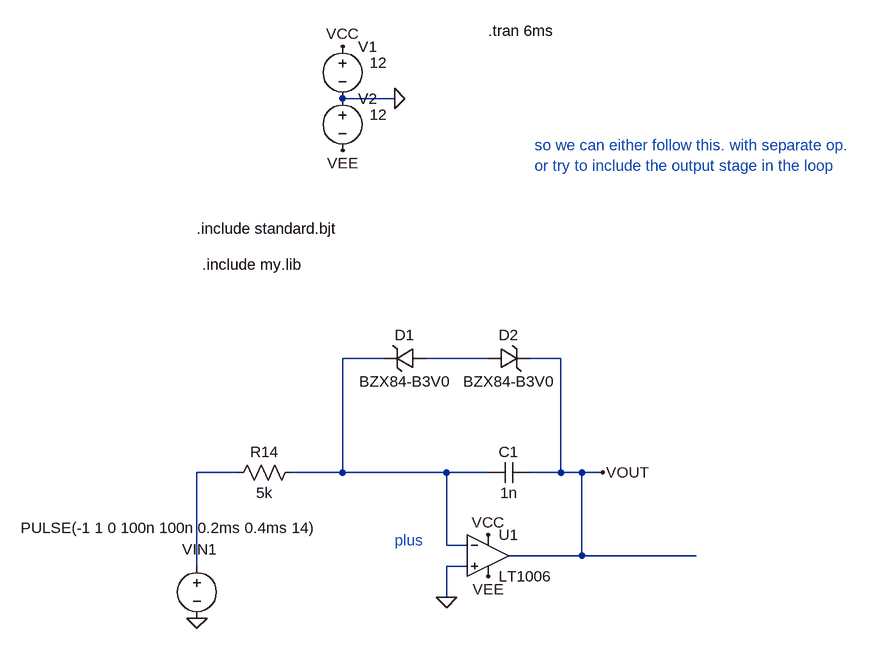
[diagram p0: schematic Draft101.asc]
Draft101.asc, the LTspice schematic file:
Version 4
SHEET 1 3300 1956
WIRE 544 -288 464 -288
WIRE 528 112 464 112
WIRE 688 112 592 112
WIRE 800 112 752 112
WIRE 304 288 240 288
WIRE 464 288 464 112
WIRE 464 288 384 288
WIRE 624 288 464 288
WIRE 688 288 624 288
WIRE 800 288 800 112
WIRE 800 288 752 288
WIRE 832 288 800 288
WIRE 864 288 832 288
WIRE 624 400 624 288
WIRE 656 400 624 400
WIRE 832 416 832 288
WIRE 832 416 720 416
WIRE 1008 416 832 416
WIRE 240 432 240 288
WIRE 656 432 624 432
WIRE 624 480 624 432
FLAG 464 -368 VCC
FLAG 240 512 0
FLAG 544 -288 0
FLAG 624 480 0
FLAG 688 384 VCC
FLAG 864 288 VOUT
FLAG 464 -208 VEE
FLAG 688 448 VEE
SYMBOL voltage 464 -384 R0
WINDOW 123 0 0 Left 0
WINDOW 39 0 0 Left 0
WINDOW 3 42 41 Left 2
SYMATTR Value 12
SYMATTR InstName V1
SYMBOL voltage 240 416 R0
WINDOW 123 0 0 Left 0
WINDOW 39 0 0 Left 0
WINDOW 3 -271 -43 Left 2
WINDOW 0 -23 -10 Left 2
SYMATTR Value PULSE(-1 1 0 100n 100n 0.2ms 0.4ms 14)
SYMATTR InstName VIN1
SYMBOL res 288 304 R270
WINDOW 0 32 56 VTop 2
WINDOW 3 0 56 VBottom 2
SYMATTR InstName R14
SYMATTR Value 5k
SYMBOL cap 752 272 R90
WINDOW 0 0 32 VBottom 2
WINDOW 3 32 32 VTop 2
SYMATTR InstName C1
SYMATTR Value 1n
SYMBOL OpAmps\\LT1006 688 352 R0
SYMATTR InstName U1
SYMBOL voltage 464 -304 R0
WINDOW 123 0 0 Left 0
WINDOW 39 0 0 Left 0
WINDOW 3 42 41 Left 2
SYMATTR Value 12
SYMATTR InstName V2
SYMBOL zener 592 96 R90
WINDOW 0 -4 32 VBottom 2
WINDOW 3 36 32 VTop 2
SYMATTR InstName D1
SYMATTR Value BZX84-B3V0
SYMATTR Description Diode
SYMATTR Type diode
SYMBOL zener 688 128 R270
WINDOW 0 36 32 VTop 2
WINDOW 3 -4 32 VBottom 2
SYMATTR InstName D2
SYMATTR Value BZX84-B3V0
SYMATTR Description Diode
SYMATTR Type diode
TEXT 688 -392 Left 2 !.tran 6ms
TEXT 544 392 Left 2 ;plus
TEXT 240 -88 Left 2 !.include standard.bjt
TEXT 760 -216 Left 2 ;so we can either follow this. with separate op.\nor try to include the output stage in the loop
TEXT 248 -32 Left 2 !.include my.lib

The netlist it stands for:
* Draft101.asc
V1 VCC 0 12
VIN1 N003 0 PULSE(-1 1 0 100n 100n 0.2ms 0.4ms 14)
R14 N003 N001 5k
C1 VOUT N001 1n
XU1 0 N001 VCC VEE VOUT LT1006  ; pins In+ In- V+ V- OUT
V2 0 VEE 12
D1 N002 N001 BZX84-B3V0
D2 N002 VOUT BZX84-B3V0
.model D D
.lib standard.dio
.tran 6ms
* plus
.include standard.bjt
* so we can either follow this. with separate op.
* or try to include the output stage in the loop
.include my.lib
.lib LTC.lib
.backanno
.end